# EAGLE design front_end_test_harness (EAGLE 6.5.0)
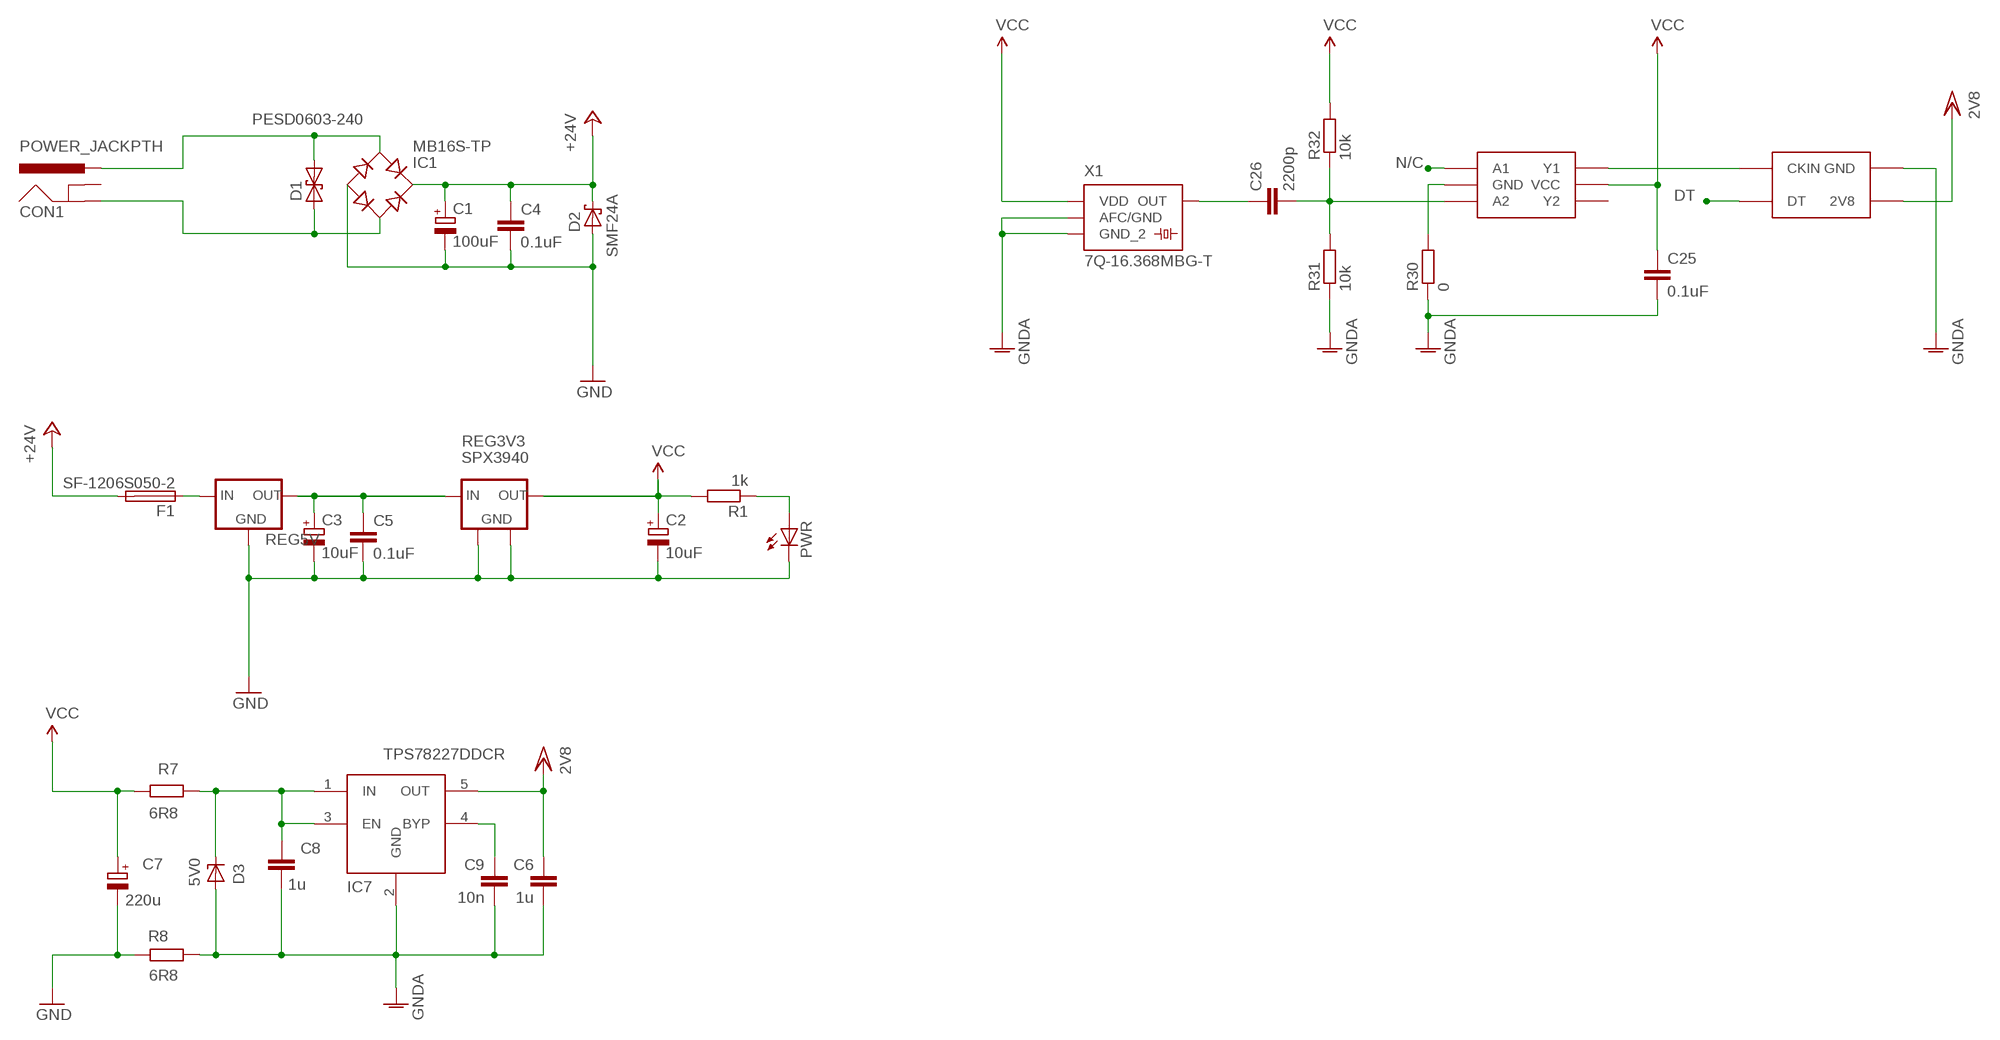
[diagram p0: schematic, sheet 1]

## Parts
C1  100uF  CPOL-EUE5-10.5  [E5-10,5]
C2  10uF  CPOL-EUE2-5  [E2-5]
C3  10uF  CPOL-EUE5-10.5  [E5-10,5]
C4  0.1uF  C-EUC0805  [C0805]
C5  0.1uF  C-EUC0805  [C0805]
C6  1u  C-EUC0603  [C0603]
C7  220u  CPOL-EU1210  [C1210]
C8  1u  C-EUC0603  [C0603]
C9  10n  C-EUC0603  [C0603]
C25  0.1uF  C-EUC0603  [C0603]
C26  2200p  C-EUC0603  [C0603]
CON1  POWER_JACKPTH  [POWER_JACK_PTH]
D1  PESD0603-240  [D0603]
D2  SMF24A  [SOD123]
D3  5V0  ZENER-DIODESOD523  [SOD523]
F1  SF-1206S050-2  [F1206]
IC1  MB16S-TP  [SOIC-4]
IC7  TPS78227DDCR  NCP700BSN  [SOT23-5]
IC26  NC7WZ16P6X  [NC7WZ16P6X]
PWR  LEDCHIPLED_0805  [CHIPLED_0805]
R1  1k  R-EU_R0603  [R0603]
R7  6R8  R-EU_R0805  [R0805]
R8  6R8  R-EU_R0805  [R0805]
R30  0  R-EU_R0603  [R0603]
R31  10k  R-EU_R0603  [R0603]
R32  10k  R-EU_R0603  [R0603]
REG3V3  SPX3940  [SOT223]
REG5V  V_REG_OKI-78SRSINK  [TO220-IGO]
U$2  TEST_HARNESS  [TEST_HARNESS]
X1  7Q-16.368MBG-T  [4-SMD]

## Nets
+2V8: C6.1 IC7.5(OUT) U$2.2V8@11(2V8) U$2.2V8@15(2V8) U$2.2V8@16(2V8) ; supply symbol labelled 2V8
+5V: C3.+ C5.1 REG3V3.1(IN) REG5V.OUT
+24V: C1.+ C4.1 D2.C F1.2 IC1.+
A2: C26.2 IC26.P$3(A2) R31.2 R32.1
BYP: C9.1 IC7.4(BYP)
CLK: IC26.P$6(Y1) U$2.CKIN@13(CKIN)
DT: U$2.DT@12(DT)
GNDA: C6.2 C8.2 C9.2 C25.2 D3.A IC7.2(GND) R8.1 R30.1 R31.1 U$2.GND@1(GND) U$2.GND@2(GND) U$2.GND@3(GND) U$2.GND@4(GND) U$2.GND@5(GND) U$2.GND@6(GND) U$2.GND@7(GND) U$2.GND@8(GND) U$2.GND@9(GND) U$2.GND@11(GND) U$2.GND@14(GND) X1.PAD_1(AFC/GND) X1.PAD_2(GND_2)
GNDINT: C1.- C2.- C3.- C4.2 C5.2 C7.2(-) D2.A IC1.- PWR.C R8.2 REG3V3.2(GND) REG3V3.4(GND) REG5V.GND ; supply symbol labelled GND
N$2: PWR.A R1.1
N$3: F1.1 REG5V.IN
N$4: IC26.P$2(GND) R30.2
N$7: CON1.PWR D1.2 IC1.~1(AC1)
N$8: CON1.GND D1.1 IC1.~2(AC2)
N$9: C26.1 X1.PAD_3(OUT)
N/C: IC26.P$1(A1)
REG2V7IN: C8.1 D3.C IC7.1(IN) IC7.3(EN) R7.1
VCC: C2.+ C7.1(+) C25.1 IC26.P$5(VCC) R1.2 R7.2 R32.2 REG3V3.3(OUT) X1.PAD_4(VDD)
Unconnected: CON1.GNDBREAK IC26.P$4(Y2)

## Library data of the parts
C1-C3 = rcl:CPOL-EU: POLARIZED CAPACITOR, European symbol
C4-C6 C8 C9 C25 C26 = rcl:C-EU: CAPACITOR, European symbol
C7 = rcl_1:CPOL-EU: POLARIZED CAPACITOR, European symbol
CON1 = SparkFun:POWER_JACK: Power Jack This is the standard 5.5mm barrel jack for power. The PTH is the most common, proven, reliable, footprint. All others are experimental. The Slot footprint only works if the mill layer is transmitted to the PCB fab house so be warned. Spark Fun Electronics SKU : PRT-00119. Mating wall wart : TOL-00298 (and others)
D1 = texas_lvds:PESD0603-240: Bi Directional Transient Voltage Suppressor Diode (0603 package) by TE connectivity
D2 = texas_lvds:SMF24A: TVS DIODE 200W SOD-123F 24V UNI by Littelfuse Inc
D3 = diode1:ZENER-DIODE: Z-Diode
F1 = texas_lvds:SF-1206S050-2: FUSE SLOW 63VDC 500MA 1206 (Manufacturer Bourns Inc.)
IC1 = texas_lvds:MB16S-TP: 1 Amp Surface Mount Schottky Bridge Rectifier 60 Volts by Micro Commercial Components
IC7 = on_ldo:NCP700B: NCP700B 200mA LDO Regulator
IC26 = texas_lvds:NC7WZ16P6X: IC BUFFER DL UHS N-INV SC706
PWR = led:LED: LED OSRAM: - CHIPLED LG R971, LG N971, LY N971, LG Q971, LY Q971, LO R971, LY R971 LH N974, LH R974 LS Q976, LO Q976, LY Q976 LO Q996 - Hyper CHIPLED LW Q18S LB Q993, LB Q99A, LB R99A - SideLED LS A670, LO A670, LY A670, LG A670, LP A670 LB A673, LV A673, LT A673, LW A673 LH A674 LY A675 LS A676, LA A676, LO A676, LY A676, LW A676 LS A679, LY A679, LG A679 - Hyper Micro SIDELED® LS Y876, LA Y876, LO Y876, LY Y876 LT Y87S - SmartLED LW L88C, LW L88S LB L89C, LB L89S, LG L890 LS L89K, LO L89K, LY L89K LS L896, LA L896, LO L896, LY L896 - TOPLED LS T670, LO T670, LY T670, LG T670, LP T670 LSG T670, LSP T670, LSY T670, LOP T670, LYG T670 LG T671, LOG T671, LSG T671 LB T673, LV T673, LT T673, LW T673 LH T674 LS T676, LA T676, LO T676, LY T676, LB T676, LH T676, LSB T676, LW T676 LB T67C, LV T67C, LT T67C, LS T67K, LO T67K, LY T67K, LW E67C LS E67B, LA E67B, LO E67B, LY E67B, LB E67C, LV E67C, LT E67C LW T67C LS T679, LY T679, LG T679 LS T770, LO T770, LY T770, LG T770, LP T770 LB T773, LV T773, LT T773, LW T773 LH T774 LS E675, LA E675, LY E675, LS T675 LS T776, LA T776, LO T776, LY T776, LB T776 LHGB T686 LT T68C, LB T68C - Hyper Mini TOPLED® LB M676 - Mini TOPLED Santana® LG M470 LS M47K, LO M47K, LY M47K Source: http://www.osram.convergy.de LUXEON: - LUMILED® LXK2-PW12-R00, LXK2-PW12-S00, LXK2-PW14-U00, LXK2-PW14-V00 LXK2-PM12-R00, LXK2-PM12-S00, LXK2-PM14-U00 LXK2-PE12-Q00, LXK2-PE12-R00, LXK2-PE12-S00, LXK2-PE14-T00, LXK2-PE14-U00 LXK2-PB12-K00, LXK2-PB12-L00, LXK2-PB12-M00, LXK2-PB14-N00, LXK2-PB14-P00, LXK2-PB14-Q00 LXK2-PR12-L00, LXK2-PR12-M00, LXK2-PR14-Q00, LXK2-PR14-R00 LXK2-PD12-Q00, LXK2-PD12-R00, LXK2-PD12-S00 LXK2-PH12-R00, LXK2-PH12-S00 LXK2-PL12-P00, LXK2-PL12-Q00, LXK2-PL12-R00 Source: www.luxeon.com KINGBRIGHT: KA-3528ASYC Source: www.kingbright.com
R1 R7 R8 R30-R32 = rcl:R-EU_: RESISTOR, European symbol
REG3V3 = texas_lvds:SPX3940: Voltage regulator with a low drop out voltage of 280mV (typical) at 1A
REG5V = texas_lvds:V_REG_OKI-78SR: Voltage Regulator Standard 7805 5V regulator. IGO (Input Ground Output). Spark Fun Electronics SKU : COM-00107
U$2 = radio_module:TEST_HARNESS
X1 = texas_lvds:7Q-16.368MBG-T

## Board
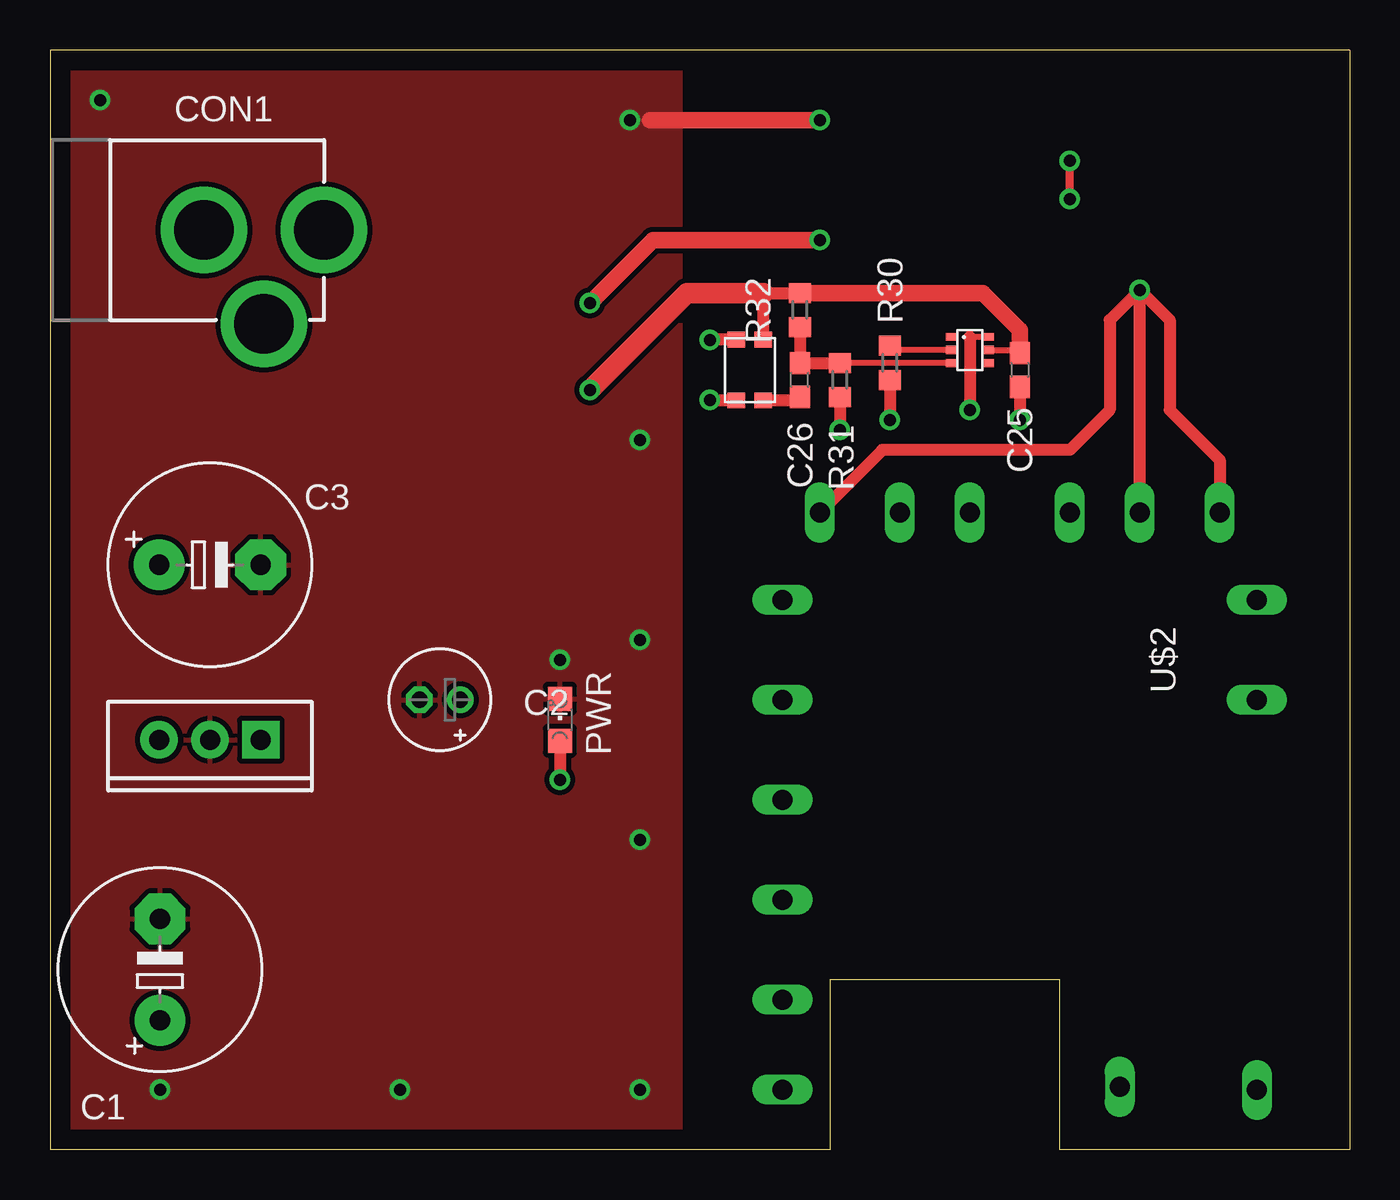
[diagram p1: board, top side]
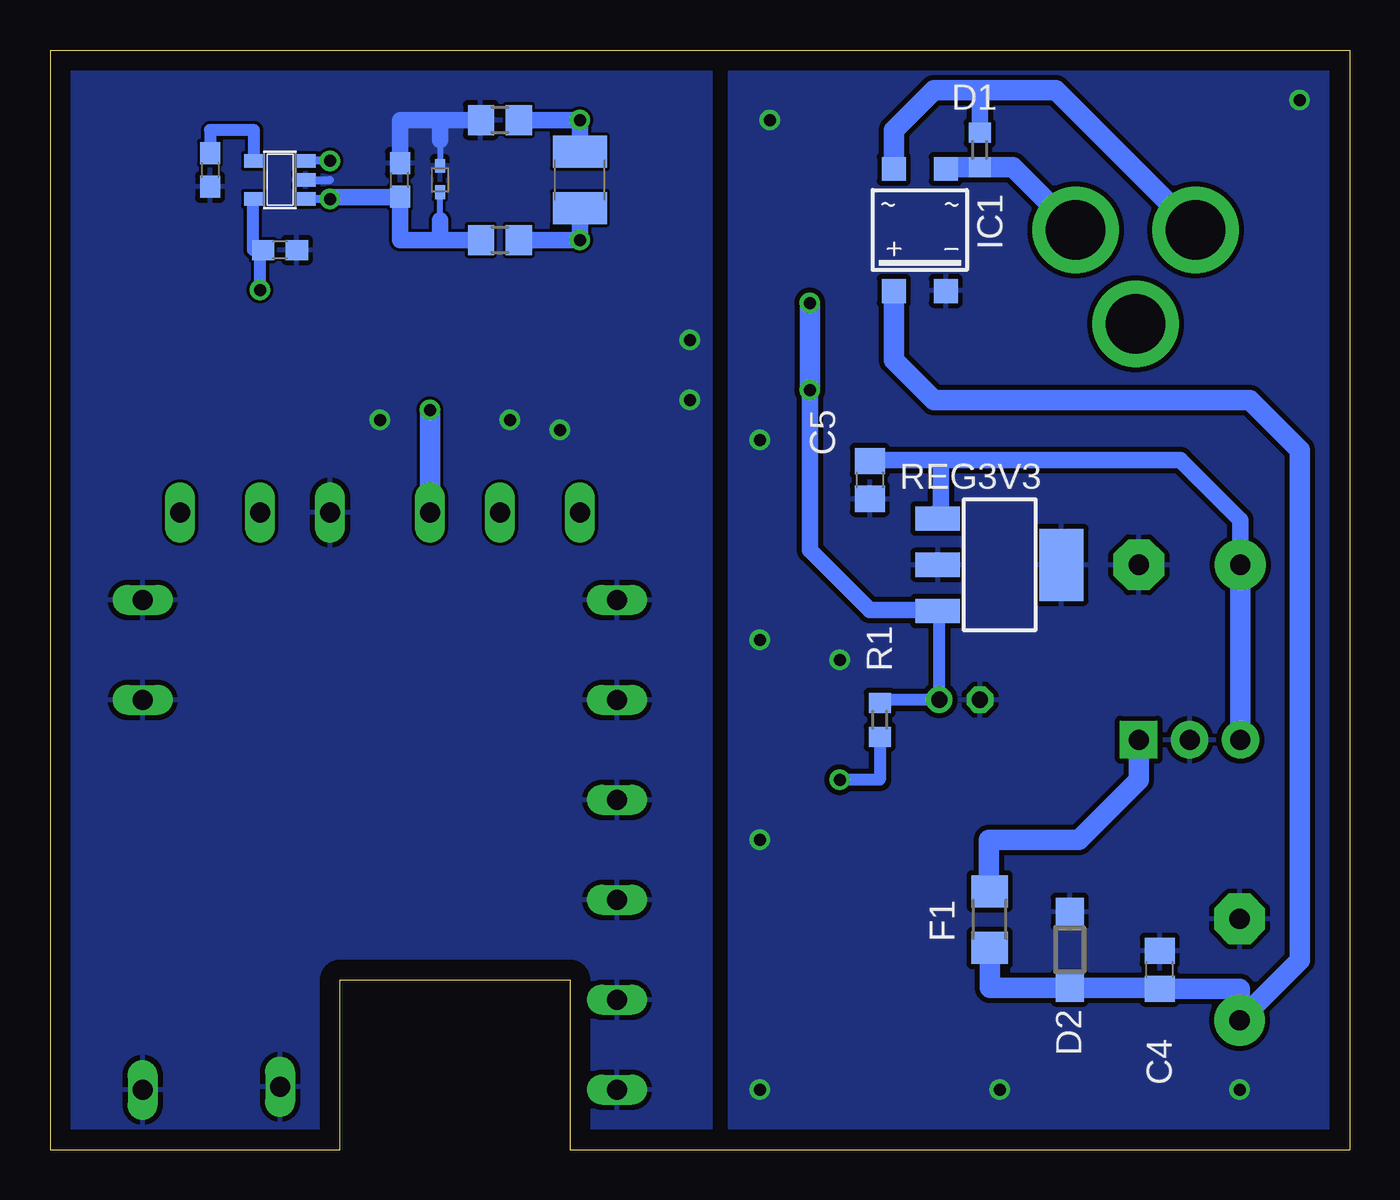
[diagram p2: board, bottom side, seen from below]

Size 65 x 55 mm. Coordinates in mm from the lower left corner, seen from the top.
Outline: 65,0 50.5,0 50.5,8.5 39,8.5 39,0 0,0 0,55 65,55 65,0
Copper layers (1*16): Top 0.035mm / dielectric 1.5mm / Bottom 0.035mm
Design rules "default": minimum track width 10mil, minimum drill 0.6mm, track to track 6mil, track to pad 6mil, pad to pad 6mil, via to via 6mil, smd to smd 6mil, copper to edge 40mil, drill to drill 8mil, minimum pad ring 10mil, minimum via ring 8mil, stop-mask expansion 4mil, vias tented up to drill 0.6mm, thermal gap 10mil

### Footprints (pad centres in the part's own frame; a part is rotated, then mirrored left to right if it is on the bottom)
E5-10,5 = drill 1.016 pad 2.54: + -2.54,0 | drill 1.016 pad 2.54 octagon: - 2.54,0
E2-5 = drill 0.813 pad 1.27: + -1.016,0 | drill 0.813 pad 1.27 octagon: - 1.016,0
C0805 = smd 1.3 x 1.5: 1 -0.95,0; 2 0.95,0
C0603 = smd 1.1 x 1: 1 -0.85,0; 2 0.85,0
C1210 = smd 1.6 x 2.7: 1 -1.4,0; 2 1.4,0
POWER_JACK_PTH = drill 2.997 pad 4.318: GND 0,7.7; GNDBREAK 4.7,10.7; PWR 0,13.7
D0603 = smd 1 x 1.1: 1 -0.85,0; 2 0.85,0
SOD123 = smd 1.4 x 1.4: A 1.9,0; C -1.9,0
SOD523 = smd 0.7 x 0.5: A 0.7,0; C -0.6,0
F1206 = smd 1.6 x 1.803: 1 -1.422,0; 2 1.422,0
SOIC-4 = smd 1.2 x 1.2: + 1.3,3.05; - -1.3,3.05; ~1 -1.3,-3.05; ~2 1.3,-3.05
SOT23-5 = smd 0.69 x 0.99: 1 -0.95,-1.29; 2 0,-1.29; 3 0.95,-1.29; 4 0.95,1.3; 5 -0.95,1.3
NC7WZ16P6X = smd 0.4 x 0.5: P$1 -0.65,-0.95; P$2 0,-0.95; P$3 0.65,-0.95; P$4 0.65,0.95; P$5 0,0.95; P$6 -0.65,0.95
CHIPLED_0805 = smd 1.2 x 1.2: A 0,-1.05; C 0,1.05
R0603 = smd 1 x 1.1: 1 -0.85,0; 2 0.85,0
R0805 = smd 1.3 x 1.5: 1 -0.95,0; 2 0.95,0
SOT223 = smd 1.219 x 2.235: 1 -2.311,-3.099; 2 0,-3.099; 3 2.311,-3.099 | smd 3.6 x 2.2: 4 0,3.099
TO220-IGO = drill 1 pad 1.88: GND 0,0; OUT 2.54,0 | drill 1 pad 1.88 square: IN -2.54,0
TEST_HARNESS = drill 1 long: 2V8@11 0.635,2.5; 2V8@15 0.635,18.5; 2V8@16 0.635,22.5; CKIN@13 0.635,10; DT@12 0.635,6.5; GND@1 5,24.365; GND@2 10,24.365; GND@3 29.517,24.365; GND@4 29.365,17.5; GND@5 29.5,0.635; GND@6 25,0.635; GND@7 20,0.635; GND@8 15,0.635; GND@9 10,0.635; GND@11 5,0.635; GND@14 0.635,15
4-SMD = smd 0.78 x 0.87: PAD_1 -1.515,-0.68; PAD_2 1.515,-0.68; PAD_3 1.515,0.68; PAD_4 -1.515,0.68

### Placement (x,y rotation side)
C1  5.5,9 90 top
C2  19.5,22.5 180 top
C3  8,29.25 0 top
C4  9.5,9 90 bottom
C5  24,33.5 270 bottom
C6  53.5,45 0 bottom
C7  38.5,48.5 90 bottom
C8  47.5,48.5 90 bottom
C9  57,49 270 bottom
C25  48.5,39 270 top
C26  37.5,38.5 90 top
CON1  0,46 270 top
D1  18.5,50 270 bottom
D2  14,10 90 bottom
D3  45.5,48.5 90 bottom
F1  18,11.5 270 bottom
IC1  21.5,46 180 bottom
IC7  53.5,48.5 90 bottom
IC26  46,40 270 top
PWR  25.5,21.5 0 top
R1  23.5,21.5 90 bottom
R7  42.5,45.5 0 bottom
R8  42.5,51.5 0 bottom
R30  42,39.35 90 top
R31  39.5,38.5 90 top
R32  37.5,42 90 top
REG3V3  17.5,29.25 270 bottom
REG5V  8,20.5 180 top
U$2  36,32.5 270 top
X1  35,39 270 top

### Tracks (layer width: path | path; a pad name or v marks a point on that pad's centre or on a via)
+2V8  (via drill 0.6)
  Top 0.61: U$2.2V8@15 v54.5,43 | U$2.2V8@11 41.63,35 51,35 53,37 53,41.5 v54.5,43 | v54.5,43 56,41.5 56,37 58.5,34.5 U$2.2V8@16
  Bottom 0.61: v54.5,43 54.5,45 C6.1 54.85,45 54.85,47.55 IC7.5
+5V
  Bottom 0.813: C3.+ 5.46,31.5 8.46,34.5 20.45,34.5 | REG3V3.1 20.6,31.5 20.45,31.5 20.45,34.5 | 20.45,34.5 24,34.5 C5.1
  Bottom 1.016: 20.6,31.79 REG3V3.1 | REG5V.OUT C3.+
+24V
  Bottom 0.61: 18.04,8.1 18,8.1
  Bottom 1.016: F1.2 18,8.1 D2.C 9.5,8.1 C4.1 5.5,8.05 C1.+ 2.5,9.46 2.5,35 5,37.5 20.8,37.5 22.8,39.5 IC1.+
A2
  Top 0.305: IC26.P$3 R31.2
  Top 0.61: 39.35,39.38 R31.2 C26.2 R32.1
BYP
  Bottom 0.61: IC7.4 54.8,51 57,51 C9.1
CLK  (via drill 0.6)
  Top 0.305: IC26.P$6 46,40.65
  Top 0.61: 46,40.65 v46,37
  Bottom 1.016: v46,37 U$2.CKIN@13
GNDA  (via drill 0.6)
  Top 0.61: X1.PAD_1 33,40.52 v33,40.5 | v33,37.5 34.32,37.5 X1.PAD_2 | R31.1 v39.5,36 | R30.1 v42,36.5 | C25.2 v48.5,36.5
  Bottom 0.305: 45.5,50.5 D3.A
  Bottom 0.406: IC7.2 51,48.5
  Bottom 0.813: R8.1 45.5,51.5 | 45.5,51.5 45.5,50.5 | C8.2 47.5,51.5 45.5,51.5
  pour Bottom: 65,0 65,55 32,55 32,0 39,0 39,8.5 50.5,8.5 50.5,0 51,0
GNDINT  (via drill 0.6)
  Top 0.813: 30,51.5 v38.5,51.5
  Bottom 0.813: C7.2 v38.5,51.5 R8.2
  other vias: 25.5,24.5 29.5,3 29.5,15.5 29.5,25.5 29.5,35.5 17.5,3 5.5,3 29,51.5 2.5,52.5
  pour Bottom (isolate 0.254): 31,55 31,0 0,0 0,55
  pour Top (isolate 0.254, rank 2): 31.5,55 31.5,0 0,0 0,55
N$2  (via drill 0.6)
  Top 0.61: PWR.A v25.5,18.5
  Bottom 0.61: R1.1 23.5,18.5 v25.5,18.5
N$3
  Bottom 0.61: F1.1 18.04,12.92
  Bottom 1.016: 18.04,12.92 18.04,15.5 13.54,15.5 10.54,18.5 REG5V.IN
N$4
  Top 0.305: IC26.P$2 42,40 R30.2
N$7
  Bottom 0.813: 20.2,49.15 IC1.~1
  Bottom 1.016: CON1.PWR 16.85,49.15 D1.2 20.2,49.15
N$8
  Bottom 0.813: D1.1 18.5,53
  Bottom 1.016: CON1.GND 14.7,53 18.5,53 20.8,53 22.8,51 IC1.~2
N$9
  Top 0.61: X1.PAD_3 37.5,37.48 C26.1
REG2V7IN  (via drill 0.6)
  Top 0.406: v51,47.55 v51,49.45
  Bottom 0.305: 45.5,46.5 D3.C
  Bottom 0.406: 52.21,49.5 IC7.3 v51,49.45 | v51,47.55 IC7.1
  Bottom 0.813: R7.1 45.5,45.5 | 45.5,45.5 45.5,46.5 | 45.5,45.5 47.5,45.5 C8.1 51,47.65 v51,47.55
VCC  (via drill 0.6)
  Top 0.305: IC26.P$5 48.5,40 C25.1
  Top 0.61: X1.PAD_4 35.68,42.85 R32.2
  Top 0.813: v38.5,45.5 30.15,45.5 v27,42.35 | R32.2 46.65,42.85 48.5,41 C25.1
  Top 1.016: 35.68,42.85 31.85,42.85 v27,38
  Bottom 0.61: 23.5,22.52 R1.2 23.5,22.5 C2.+ 20.52,26.94 REG3V3.3
  Bottom 0.813: REG3V3.3 20.6,27 24,27 27,30 v27,38 | C7.1 v38.5,45.5 R7.2
  Bottom 1.016: v27,38 v27,42.35